# Altium schematic sheet Sheet1.SchDoc
size A
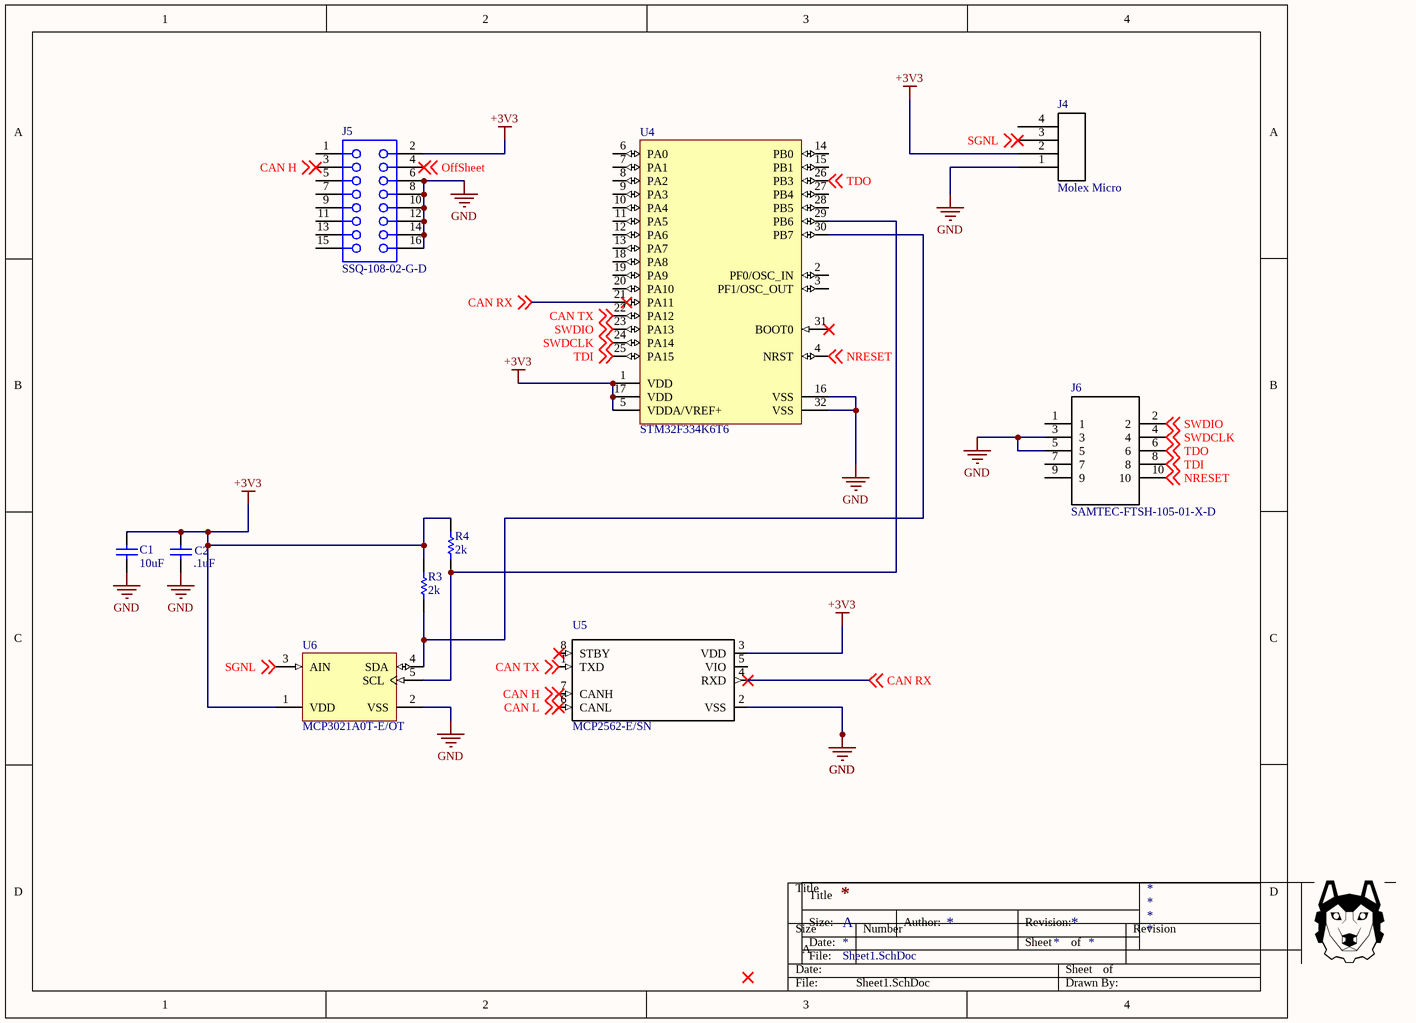
[diagram p0: Sheet1.SchDoc]

## Parts
C1  10uF  [Cap 0805]
C2  .1uF  [Cap 0805]
J4  Molex Micro  [0430450427]
J5  SSQ-108-02-G-D  [SMTC-SSQ-108-02-X-D]
J6  SAMTEC-FTSH-105-01-X-D  [SAMTEC-FTSH-105-01-X-D]
R3  2k  [RESC0805(2012)_N]
R4  2k  [RESC0805(2012)_N]
U4  STM32F334K6T6  [STM-LQFP32_N]
U5  MCP2562-E/SN  [SOIC127P600X175-8N]
U6  MCP3021A0T-E/OT  [SOT-23-OT5_M]

## Nets
+3V3: C1.2 C2.2 J4.2 J5.2 R3.2 R4.2 U4.1(VDD) U4.5(VDDA/VREF+) U4.17(VDD) U5.3(VDD) U6.1(VDD)
GND: C1.1 C2.1 J4.1 J5.6 J5.8 J5.10 J5.12 J5.14 J5.16 J6.3 J6.5 U4.16(VSS) U4.32(VSS) U5.2(VSS) U6.2(VSS)
CAN H: J5.3 U5.7(CANH) ; off-sheet CAN H
CAN L: U5.6(CANL) ; off-sheet CAN L
CAN RX: U4.21(PA11) U5.4(RXD) ; off-sheet CAN RX
CAN TX: U4.22(PA12) U5.1(TXD) ; off-sheet CAN TX
NRESET: J6.10 U4.4(NRST) ; off-sheet NRESET
OffSheet: J5.4 ; off-sheet OffSheet
SGNL: J4.3 U6.3(AIN) ; off-sheet SGNL
SWDCLK: J6.4 U4.24(PA14) ; off-sheet SWDCLK
SWDIO: J6.2 U4.23(PA13) ; off-sheet SWDIO
TDI: J6.8 U4.25(PA15) ; off-sheet TDI
TDO: J6.6 U4.26(PB3) ; off-sheet TDO
NetR3_1: R3.1 U4.30(PB7) U6.4(SDA)
NetR4_1: R4.1 U4.29(PB6) U6.5(SCL)

Not connected (* = marked no-connect by the designer): J4 4; J5 1 5 7 9 11 13 15; J6 1 7 9; U4 2(PF0/OSC_IN) 3(PF1/OSC_OUT) 6(PA0) 7(PA1) 8(PA2) 9(PA3) 10(PA4) 11(PA5) 12(PA6) 13(PA7) 14(PB0) 15(PB1) 18(PA8) 19(PA9) 20(PA10) 27(PB4) 28(PB5) 31(BOOT0)*; U5 5(VIO) 8(STBY)*

## Notes on the sheet
- Title
- Size:
- Date:
- File:
- A
- Author:
- Revision:
- Sheet
- of

## Library data of the parts
C1 C2 = Capacitor 0805: Standard Capacitor; Manufacturer: AVX; Tolerance (%): ±10%; Dielectric: X5R; Rated Voltage: 10V; Capacitance: 2.2µF; Datasheet Version: 05/2016; Manufacturer URL: http://www.avx.com/; Package Description: 2-Pin Surface Mount Device, Body 2.01 x 1.25 mm; Mounting Technology: SurfaceMount; Case Size/Dimension: 0805; Package Reference: 0805; Datasheet URL: http://datasheets.avx.com/cx5r.pdf
J4 = Molex micro-fit 4-pin (Single row schematic): Molex micro-fit 3.0 dual row header. P/N 0430450427
J5 = CMP-1023-00300-1: SQ Post Socket, Through-hole, Vertical, -55 to 125 degC, 2.54 mm Pitch, 16-Pin, Female, RoHS; Manufacturer: Samtec; Pitch: 2.54 mm; ComponentLink2URL: http://www.samtec.com/documents/webfiles/pdf/SSQ_TH.PDF; ComponentLink3Description: Package Specification; Mounting Technology: Through-hole; RoHS: True; PackageReference: SSQ-108-02-X-D; PartNumber: SSQ-108-02-G-D; Orientation: Vertical; ComponentLink1URL: http://www.samtec.com; DatasheetVersion: F-214; Temperature Range: -55 to 125 degC; PackageDescription: Assembly, Socket Strip .025[0.64] SQ Tail; PackageVersion: BD, 6/1987; ComponentLink2Description: Datasheet; ComponentLink1Description: Manufacturer URL; ComponentLink3URL: http://www.samtec.com/documents/webfiles/cpdf/SSQ-1XX-XX-XXX-X-XX-XXX-XX-X-MKT.pdf
R3 R4 = 120R 5% 0805: 120R 0.125W 5% 0805 (2012 Metric)  SMD; Case-Metric: 2012; Value: 120.00 Ohm; Case-EIA: 0805; Tolerance: 5 %; Technology: SMT; Power: 0.125 W
U4 = STM32F334K6T6: ARM Cortex-M4 32-bit MCU, 32-Pin LQFP, 32 KB Flash, 16 KB Internal RAM, 25 I/Os, -40 to 85 degC, Tray; D/A Converter: 3; Internal RAM Size (kB): 16; I/Os (High Current): 25; Supply Voltage(Vcc) min (V): 2; Operating Frequency(F) (Processor speed) (MHz): 72; FLASH Size (Prog) (kB): 32; ComponentLink1Description: Manufacturer URL; Mounting Technology: Surface Mount; ComponentLink1URL: http://www.st.com/; Package Description: 32-Pin Low Profile Quad Flat Package, 7 x 7 mm Body, 0.8 mm Pitch; ComponentLink2URL: http://www.st.com/st-web-ui/static/active/en/resource/technical/document/datasheet/DM00097745.pdf; Packing: Tray; Package Reference: LQFP32; Core: ARM Cortex-M4; ComponentLink2Description: Datasheet; DatasheetVersion: Rev. 4
U5 = CAN Tranceiver: Microchip MCP2562-E/SN, CAN Transceiver 1MBps 1-channel IEC 61000-4-2, 8-Pin SOIC; Price: None; MF: Microchip; SnapEDA_Link: https://www.snapeda.com/parts/MCP2562-E/SN/Microchip/view-part/?ref=snap; MP: MCP2562-E/SN; Availability: Unavailable; Package: SO-8 Microchip; Value: *
U6 = CMP-0188-01214-1: Low Power 10-Bit A/D Converter With I2C Interface, 5-Pin SOT-23, Extended Temperature, Tape and Reel; ComponentLink1Description: Manufacturer URL; PackageVersion: revBB, Aug-2009; ComponentLink1URL: http://www.microchip.com/; ComponentLink2URL: http://ww1.microchip.com/downloads/en/DeviceDoc/21805a.pdf; ComponentLink2Description: Datasheet; PackageReference: SOT-23-OT5; ComponentLink3Description: Package Specification; Code_IPC: SOT23-5; DatasheetVersion: revA, May-2003; PackageDescription: 5-Lead Plastic Small Outline Transistor (OT) [SOT-23]; ComponentLink3URL: http://www.microchip.com/stellent/groups/techpub_sg/documents/packagingspec/en012702.pdf